# EAGLE design lis2dh12 (EAGLE 7.3.0)
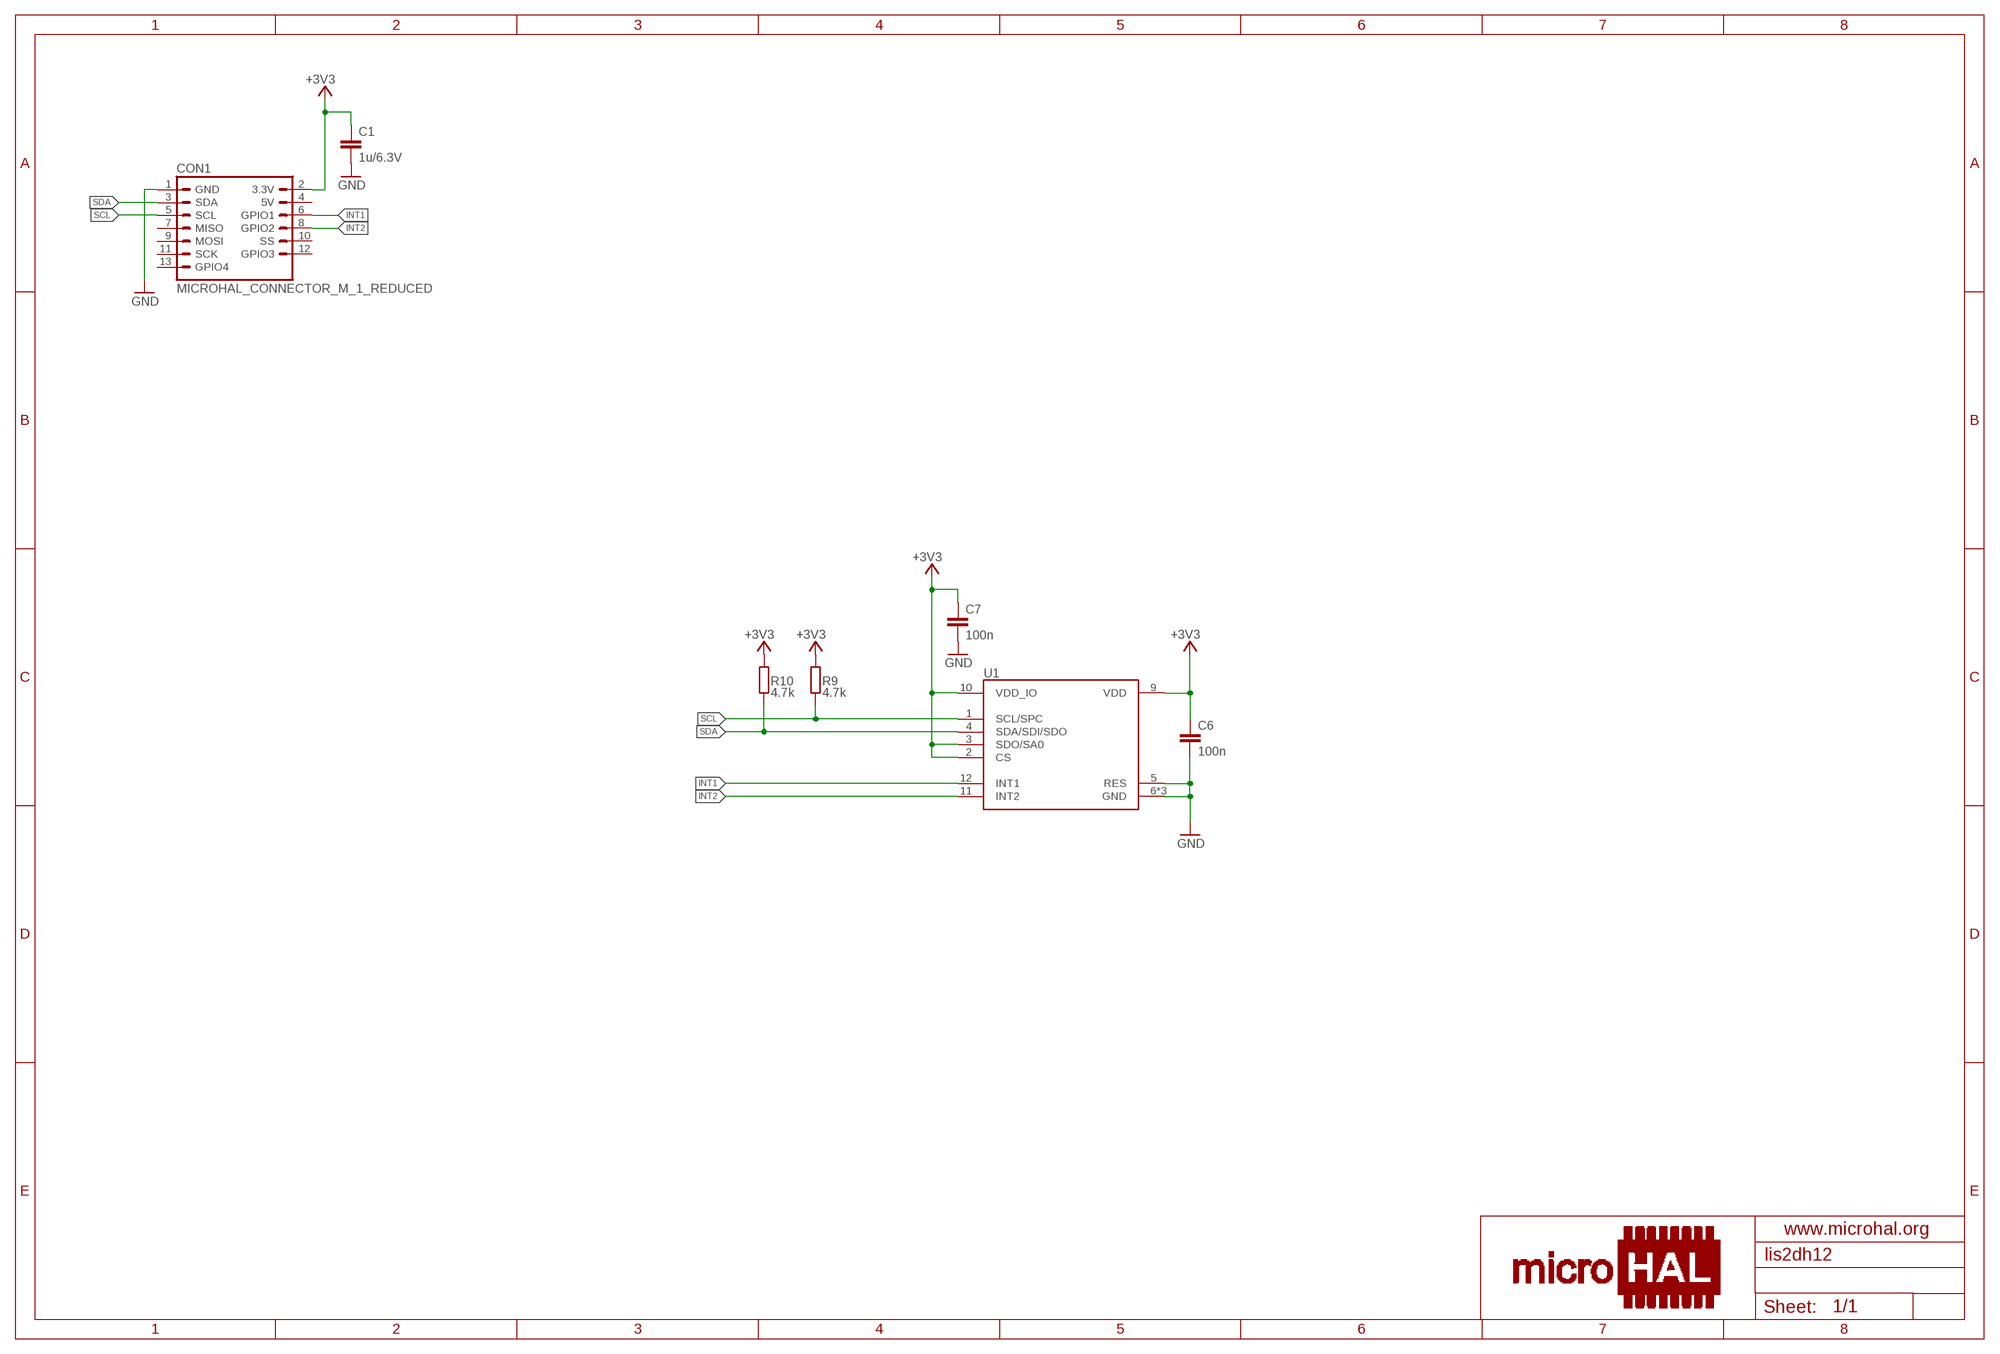
[diagram p0: schematic, sheet 1]

## Parts
C1  1u/6.3V  C-EUC0603K  [C0603K]
C6  100n  C-EUC0603K  [C0603K]
C7  100n  C-EUC0603K  [C0603K]
CON1  MICROHAL_CONNECTOR_M_1_REDUCED  [MICROHAL_CONNECTOR_M_1_REDUCED_EDGE]
R9  4.7k  R-EU_R0603  [R0603]
R10  4.7k  R-EU_R0603  [R0603]
U1  LIS2DH12  [LGA-12]

## Nets
+3V3: C1.1 C6.1 C7.1 CON1.2(3.3V) R9.1 R10.1 U1.2(CS) U1.3(SDO/SA0) U1.9(VDD) U1.10(VDD_IO)
GND: C1.2 C6.2 C7.2 CON1.1(GND) U1.5(RES) U1.6(GND) U1.7(GND) U1.8(GND)
INT1: CON1.6(GPIO1) U1.12(INT1)
INT2: CON1.8(GPIO2) U1.11(INT2)
SCL: CON1.5(SCL) R9.2 U1.1(SCL/SPC)
SDA: CON1.3(SDA) R10.2 U1.4(SDA/SDI/SDO)
Unconnected: CON1.4(5V) CON1.7(MISO) CON1.9(MOSI) CON1.10(SS) CON1.11(SCK) CON1.12(GPIO3) CON1.13(GPIO4)

## Library data of the parts
C1 C6 C7 = rcl:C-EU: CAPACITOR, European symbol
CON1 = microhal-connector_v2:MICROHAL_CONNECTOR_M_1_REDUCED
R9 R10 = rcl:R-EU_: RESISTOR, European symbol
U1 = lis2dh12:LIS2DH12

## Board
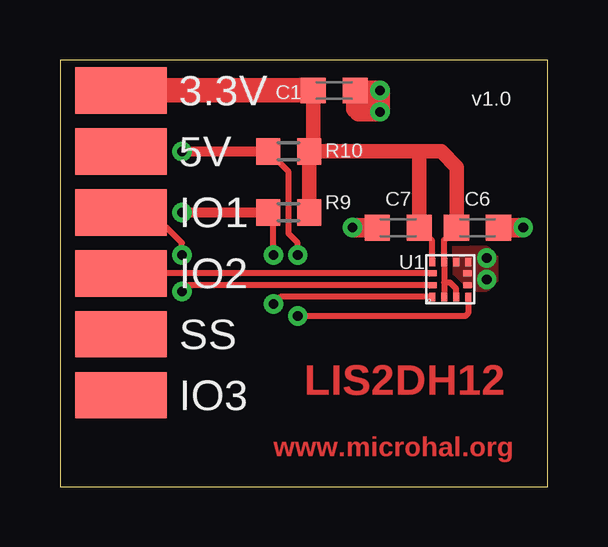
[diagram p1: board, top side]
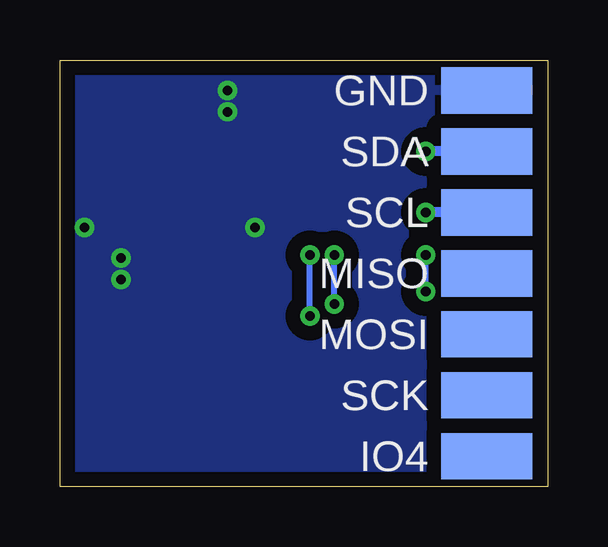
[diagram p2: board, bottom side, seen from below]

Size 20.32 x 17.78 mm. Coordinates in mm from the lower left corner, seen from the top.
Outline: 0,0 20.32,0 20.32,17.78 0,17.78 0,0
Copper layers (1*16): Top 0.035mm / dielectric 1.5mm / Bottom 0.035mm
Design rules "default *": minimum track width 10mil, minimum drill 14mil, track to track 8mil, track to pad 8mil, pad to pad 8mil, via to via 8mil, smd to smd 1mil, copper to edge 20mil, drill to drill 8mil, minimum pad ring 10mil, minimum via ring 8mil, stop-mask expansion 4mil, vias tented up to drill 0mil, thermal gap 10mil

### Footprints (pad centres in the part's own frame; a part is rotated, then mirrored left to right if it is on the bottom)
C0603K = smd 1.05 x 1.08: 1 -0.875,0; 2 0.875,0
MICROHAL_CONNECTOR_M_1_REDUCED_EDGE = smd 1.93 x 3.81 bottom: 1 -7.62,0; 3 -5.08,0; 5 -2.54,0; 7 0,0; 9 2.54,0; 11 5.08,0; 13 7.62,0 | smd 1.93 x 3.81: 2 -7.62,0; 4 -5.08,0; 6 -2.54,0; 8 0,0; 10 2.54,0; 12 5.08,0
R0603 = smd 1 x 1.1: 1 -0.85,0; 2 0.85,0
LGA-12 = smd 0.35 x 0.25: 1 -0.725,0.75; 2 -0.725,0.25; 3 -0.725,-0.25; 4 -0.725,-0.75; 7 0.725,-0.75; 8 0.725,-0.25; 9 0.725,0.25; 10 0.725,0.75 | smd 0.25 x 0.35: 5 -0.25,-0.725; 6 0.25,-0.725; 11 0.25,0.725; 12 -0.25,0.725

### Placement (x,y rotation side)
C1  11.43,16.51 0 top
C6  17.4,10.79 0 top
C7  14.1,10.79 180 top
CON1  2.54,8.89 270 top
R9  9.53,11.43 180 top
R10  9.53,13.97 180 top
U1  16.26,8.64 90 top

### Tracks (layer width: path | path; a pad name or v marks a point on that pad's centre or on a via)
+3V3
  Top 0.254: U1.10 15.51,10.26 C7.1 | C6.1 16.01,10.28 U1.9 16.01,8.51 | 16.01,8.51 U1.2 | U1.3 16.51,8.25 16.51,8.26 16.26,8.51 16.01,8.51
  Top 0.61: R9.1 R10.1 | R10.1 10.55,14.15 C1.1 | C7.1 14.97,13.6 14.99,13.97 | 14.99,13.97 R10.1 | C6.1 16.52,13.32 15.88,13.97 14.99,13.97
  Top 1.016: CON1.2 C1.1
GND  (via drill 0.4)
  Top 0.813: v19.3,10.79 C6.2 | v12.19,10.79 C7.2 | C1.2 12.32,16.51 | v13.34,15.62 12.45,15.62 12.32,15.75 12.32,16.51 | 12.32,16.51 v13.34,16.51 v13.34,15.62 | v13.34,15.62 12.57,15.62 12.57,16.38
  other vias: 17.78,9.53 17.78,8.64
  pour Bottom (isolate 0.61): 0,17.78 20.32,17.78 20.32,0 0,0 0,3.17
  pour Top (no thermals): 17.78,9.91 15.88,9.91 15.88,8.26 17.78,8.26 18.16,8.64 18.16,9.53
INT1  (via drill 0.4)
  Top 0.254: U1.12 5.34,8.39 v5.08,8.13 | v5.08,9.65 5.08,10.16 4.45,10.79 3.17,10.79 CON1.6
  Bottom 0.254: v5.08,8.13 v5.08,9.65
INT2
  Top 0.254: U1.11 CON1.8
SCL  (via drill 0.4)
  Top 0.254: U1.1 9.18,7.91 v8.89,7.62 | v8.89,9.65 8.89,11.21 R9.2
  Top 0.406: v5.08,11.43 R9.2
  Bottom 0.254: v8.89,7.62 v8.89,9.65
  Bottom 0.406: CON1.5 v5.08,11.43
SDA  (via drill 0.4)
  Top 0.254: U1.4 17.01,7.23 16.89,7.11 v9.91,7.11 | v9.91,9.65 9.91,10.16 9.53,10.54 9.53,13.12 R10.2
  Top 0.406: v5.08,13.97 R10.2
  Bottom 0.254: v9.91,7.11 v9.91,9.65
  Bottom 0.406: CON1.3 v5.08,13.97

### Text on the board
Top: LIS2DH12 | www.microhal.org
tPlace: v1.0
tStop: LIS2DH12 | www.microhal.org